# Altium schematic sheet 05-MUX.SchDoc
size A4; DocumentNumber: 5; SheetNumber: 5; SheetTotal: 8
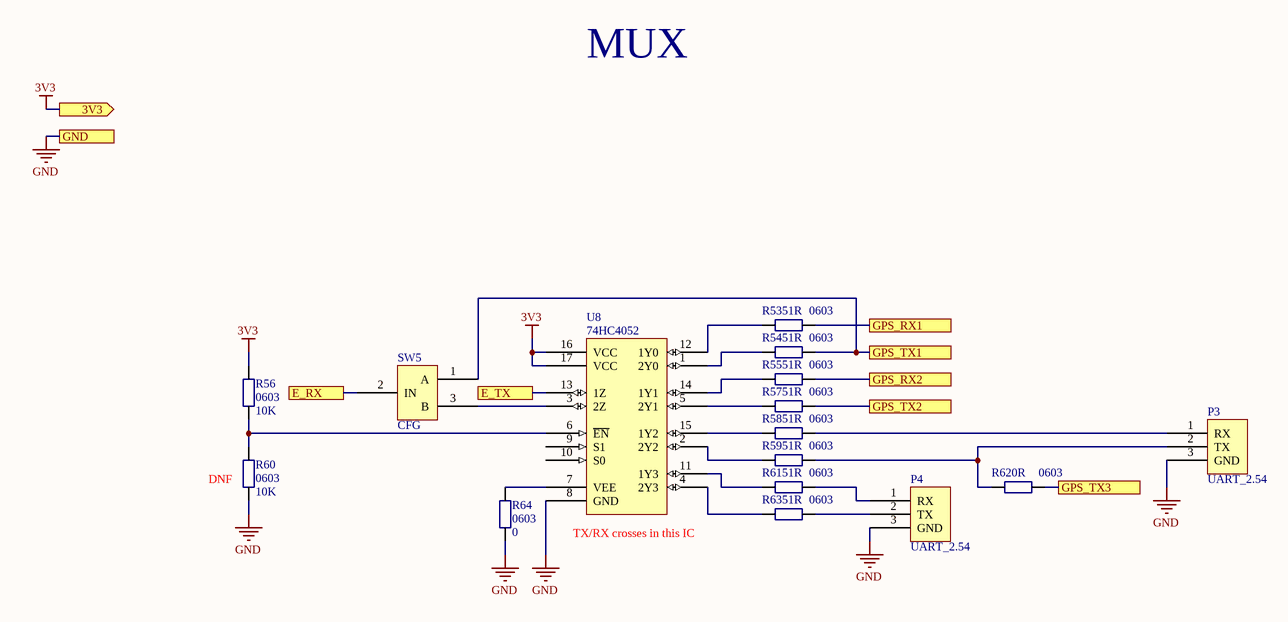
[diagram p0: 05-MUX.SchDoc]

## Parts
P3  UART_2.54  [UART_2.54]
P4  UART_2.54  [UART_2.54]
R53  Size: 0603  Resistance: 51R  [R0604]
R54  Size: 0603  Resistance: 51R  [R0604]
R55  Size: 0603  Resistance: 51R  [R0604]
R56  Size: 0603  Resistance: 10K  [R0604]
R57  Size: 0603  Resistance: 51R  [R0604]
R58  Size: 0603  Resistance: 51R  [R0604]
R59  Size: 0603  Resistance: 51R  [R0604]
R60  Size: 0603  Resistance: 10K  [R0604]
R61  Size: 0603  Resistance: 51R  [R0604]
R62  Size: 0603  Resistance: 0R  [R0604]
R63  Size: 0603  Resistance: 51R  [R0604]
R64  Size: 0603  Resistance: 0  [R0604]
SW5  CFG  [CFG_0603]
U8  74HC4052  [TSSOP16-SOP65P637X110-17N]

## Ports
3V3 (out), E_RX, E_TX, GND, GPS_RX1, GPS_RX2, GPS_TX1, GPS_TX2, GPS_TX3

## Nets
3V3: R56.1 U8.16(VCC) U8.17(VCC) ; port 3V3
GND: P3.3(GND) P4.3(GND) R60.2 R64.1 U8.8(GND) ; port GND
E_RX: SW5.2(IN) ; port E_RX
E_TX: U8.13(1Z) ; port E_TX
GPS_RX1: R53.2 ; port GPS_RX1
GPS_RX2: R55.2 ; port GPS_RX2
GPS_TX1: R54.2 SW5.1(A) ; port GPS_TX1
GPS_TX2: R57.2 ; port GPS_TX2
GPS_TX3: R62.2 ; port GPS_TX3
NetP3_1: P3.1(RX) R58.2
NetP3_2: P3.2(TX) R59.2 R62.1
NetP4_1: P4.1(RX) R61.2
NetP4_2: P4.2(TX) R63.2
NetR53_1: R53.1 U8.12(1Y0)
NetR54_1: R54.1 U8.1(2Y0)
NetR55_1: R55.1 U8.14(1Y1)
NetR56_2: R56.2 R60.1 U8.6(~{EN})
NetR57_1: R57.1 U8.5(2Y1)
NetR58_1: R58.1 U8.15(1Y2)
NetR59_1: R59.1 U8.2(2Y2)
NetR61_1: R61.1 U8.11(1Y3)
NetR63_1: R63.1 U8.4(2Y3)
NetR64_2: R64.2 U8.7(VEE)
NetSW5_3: SW5.3(B) U8.3(2Z)

Not connected (* = marked no-connect by the designer): U8 9(S1) 10(S0)

## Notes on the sheet
- MUX
- (near R60) DNF
- (near U8) TX/RX crosses in this IC

## Library data of the parts
R53-R64 = R_GENERAL: Resistor General
U8 = 74HC4052: Dual 4-channel analog multiplexer/demultiplexer; MP: 74HC4052PW; MF: NXP; Availability: Unavailable; Package: TSSOP-16; Price: None; Value: *